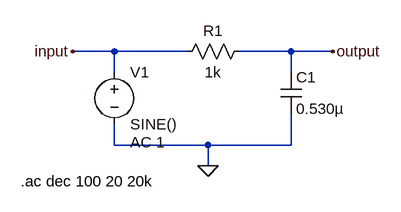
[diagram p0: schematic low-pass-filter.asc]
low-pass-filter.asc, the LTspice schematic file:
Version 4
SHEET 1 880 680
WIRE 32 96 -32 96
WIRE 144 96 32 96
WIRE 304 96 224 96
WIRE 368 96 304 96
WIRE 32 128 32 96
WIRE 304 128 304 96
WIRE 32 240 32 208
WIRE 176 240 32 240
WIRE 304 240 304 192
WIRE 304 240 176 240
WIRE 176 272 176 240
FLAG 176 272 0
FLAG -32 96 input
FLAG 368 96 output
SYMBOL voltage 32 112 R0
WINDOW 123 24 124 Left 2
WINDOW 39 0 0 Left 0
SYMATTR Value2 AC 1
SYMATTR InstName V1
SYMATTR Value SINE()
SYMBOL res 240 80 R90
WINDOW 0 0 56 VBottom 2
WINDOW 3 32 56 VTop 2
SYMATTR InstName R1
SYMATTR Value 1k
SYMBOL cap 288 128 R0
SYMATTR InstName C1
SYMATTR Value 0.530µ
TEXT -112 296 Left 2 !.ac dec 100 20 20k

The netlist it stands for:
* low-pass-filter.asc
V1 input 0 SINE() AC 1
R1 output input 1k
C1 output 0 0.530µ
.ac dec 100 20 20k
.backanno
.end

* Results of the author's LTspice run, read from the files saved beside the schematic
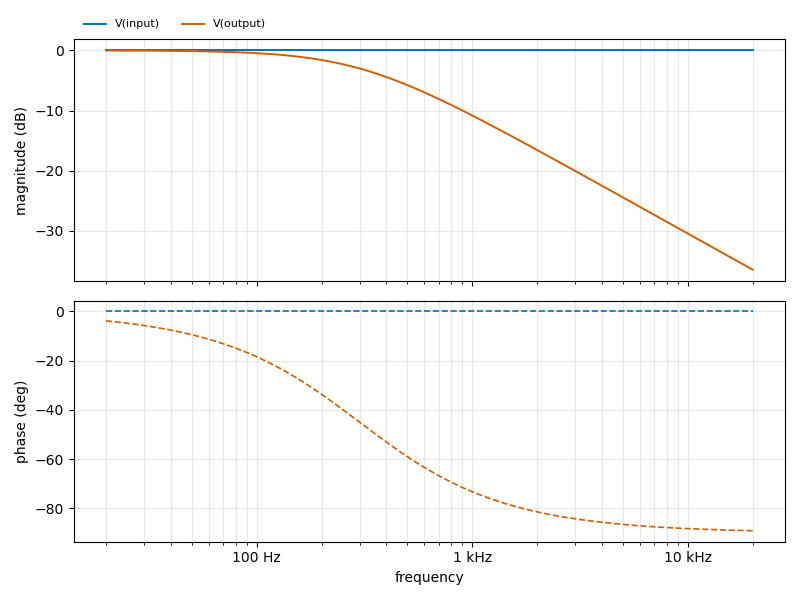
[diagram p1: AC Analysis of low-pass-filter.asc, plotted from the saved traces]
* AC Analysis, 1 run:
*   V(input): 0.00 dB at 20 Hz, 0.00 dB at 20 kHz, peak 0.00 dB at 20 Hz
*   V(output): -0.02 dB at 20 Hz, -36.47 dB at 20 kHz, peak -0.02 dB at 20 Hz, 3 dB below the peak at 301.6 Hz